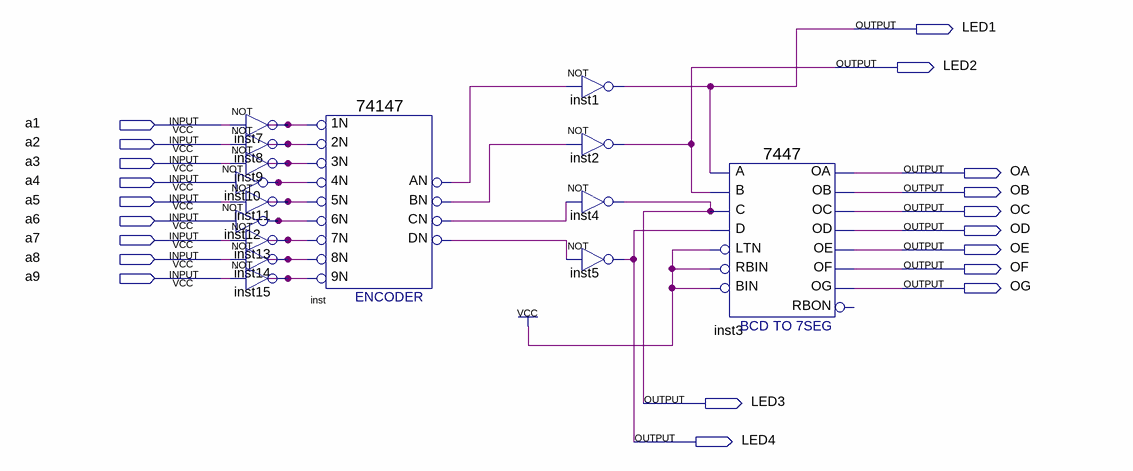
[diagram p0: schematic sheet]
// Quartus schematic THR2023063114.bdf as structural Verilog: 15 symbols, 20 pins
module THR2023063114 (
  input  a1,
  input  a2,
  input  a3,
  input  a4,
  input  a5,
  input  a6,
  input  a7,
  input  a8,
  input  a9,
  output LED1,
  output LED2,
  output OA,
  output OB,
  output OC,
  output OD,
  output OE,
  output OF,
  output OG,
  output LED3,
  output LED4
);

  wire inst7_out, inst8_out, inst9_out, inst10_out, inst11_out, inst12_out, inst13_out, inst14_out,
       inst15_out, inst_an, inst_bn, inst_cn, inst_dn;

  not inst7 (inst7_out, a1);
  not inst8 (inst8_out, a2);
  not inst9 (inst9_out, a3);
  not inst10 (inst10_out, a4);
  not inst11 (inst11_out, a5);
  not inst12 (inst12_out, a6);
  not inst13 (inst13_out, a7);
  not inst14 (inst14_out, a8);
  not inst15 (inst15_out, a9);
  \74147  inst (
    .\1N (inst7_out), .\2N (inst8_out), .\3N (inst9_out), .\6N (inst12_out), .\5N (inst11_out),
    .\4N (inst10_out), .\9N (inst15_out), .\8N (inst14_out), .\7N (inst13_out), .CN(inst_cn), .BN(inst_bn),
    .AN(inst_an), .DN(inst_dn));
  not inst1 (LED1, inst_an);
  not inst2 (LED2, inst_bn);
  not inst4 (LED3, inst_cn);
  not inst5 (LED4, inst_dn);
  \7447  inst3 (
    .LTN(1'b1), .B(LED2), .C(LED3), .D(LED4), .RBIN(1'b1), .BIN(1'b1), .A(LED1), .OB(OB), .OC(OC), .OE(OE),
    .OD(OD), .OF(OF), .OG(OG), .OA(OA));  // open: RBON
endmodule
